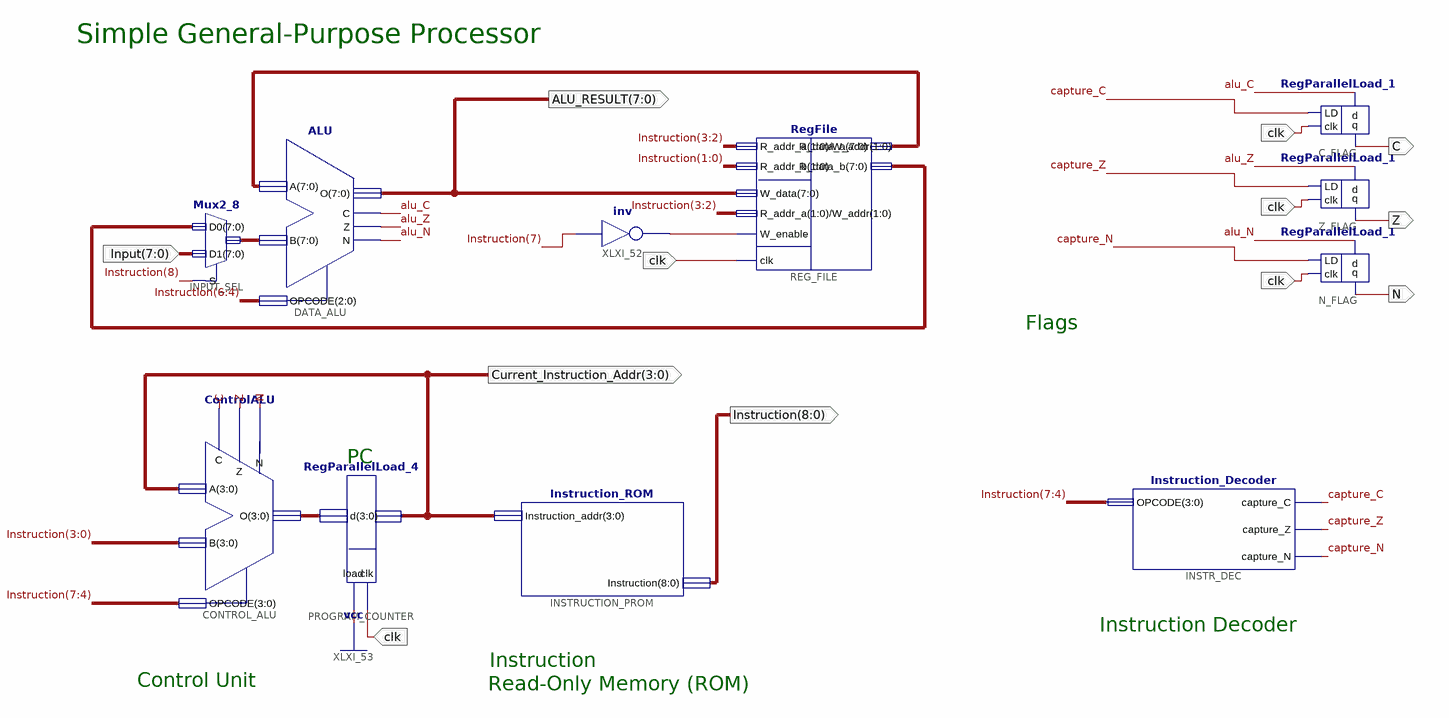
[diagram p0: schematic sheet 1]
// Xilinx ISE schematic GPP.sch (spartan6) as structural Verilog: 11 symbols, 8 ports
module GPP (
  input  clk,
  input  [7:0] Input,
  output C,
  output N,
  output Z,
  output [3:0] Current_Instruction_Addr,
  output [8:0] Instruction,
  output [7:0] ALU_RESULT
);

  wire alu_C, alu_N, alu_Z, capture_C, capture_N, capture_Z, write_enable_registers;
  wire [3:0] PC_NEXT;
  wire [7:0] Output_A, Output_B, XLXN_73;

  RegParallelLoad_1 Z_FLAG (.LD(capture_Z), .clk(clk), .d(alu_Z), .q(Z));
  RegParallelLoad_1 C_FLAG (.LD(capture_C), .clk(clk), .d(alu_C), .q(C));
  RegParallelLoad_1 N_FLAG (.LD(capture_N), .clk(clk), .d(alu_N), .q(N));
  Instruction_Decoder INSTR_DEC (
    .OPCODE(Instruction[7:4]), .capture_C(capture_C), .capture_Z(capture_Z), .capture_N(capture_N));
  ControlALU CONTROL_ALU (
    .A(Current_Instruction_Addr), .B(Instruction[3:0]), .O(PC_NEXT), .OPCODE(Instruction[7:4]), .N(N), .Z(Z),
    .C(C));
  Instruction_ROM INSTRUCTION_PROM (.Instruction_addr(Current_Instruction_Addr), .Instruction(Instruction));
  RegParallelLoad_4 PROGRAM_COUNTER (.clk(clk), .load(1'b1), .d(PC_NEXT), .q(Current_Instruction_Addr));
  RegFile REG_FILE (
    .R_addr_b(Instruction[1:0]), .R_addr_a(Instruction[3:2]), .clk(clk), .W_data(ALU_RESULT),
    .W_addr(Instruction[3:2]), .W_enable(write_enable_registers), .R_data_a(Output_A), .R_data_b(Output_B));
  ALU DATA_ALU (.B(XLXN_73), .A(Output_A), .OPCODE(Instruction[6:4]), .O(ALU_RESULT), .C(alu_C), .Z(alu_Z), .N(alu_N));
  Mux2_8 INPUT_SEL (.O(XLXN_73), .D0(Output_B), .D1(Input), .S(Instruction[8]));
  not XLXI_52 (write_enable_registers, Instruction[7]);

  // Notes on the sheet:
  //   Simple General-Purpose Processor
  //   Flags
  //   PC
  //   Instruction Decoder
  //   Instruction
  //   Control Unit
  //   Read-Only Memory (ROM)
endmodule
